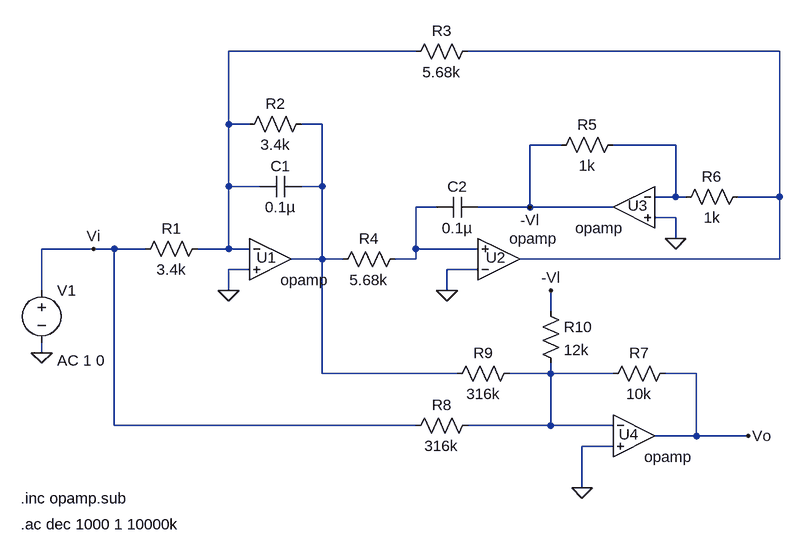
[diagram p0: schematic Circuito_8c.asc]
Circuito_8c.asc, the LTspice schematic file:
Version 4
SHEET 1 1172 680
WIRE 352 -176 64 -176
WIRE 912 -176 432 -176
WIRE 64 -64 64 -176
WIRE 96 -64 64 -64
WIRE 208 -64 176 -64
WIRE 576 -32 528 -32
WIRE 752 -32 656 -32
WIRE 64 32 64 -64
WIRE 112 32 64 32
WIRE 208 32 208 -64
WIRE 208 32 176 32
WIRE 752 48 752 -32
WIRE 752 48 720 48
WIRE 768 48 752 48
WIRE 912 48 912 -176
WIRE 912 48 848 48
WIRE 384 64 352 64
WIRE 528 64 528 -32
WIRE 528 64 448 64
WIRE 656 64 528 64
WIRE 752 80 720 80
WIRE 752 112 752 80
WIRE -144 128 -224 128
WIRE -112 128 -144 128
WIRE -64 128 -112 128
WIRE 64 128 64 32
WIRE 64 128 16 128
WIRE 96 128 64 128
WIRE 352 128 352 64
WIRE 448 128 352 128
WIRE 208 144 208 32
WIRE 208 144 160 144
WIRE 240 144 208 144
WIRE 352 144 352 128
WIRE 352 144 320 144
WIRE 912 144 912 48
WIRE 912 144 512 144
WIRE 96 160 64 160
WIRE 448 160 400 160
WIRE -224 192 -224 128
WIRE 64 192 64 160
WIRE 400 192 400 160
WIRE 560 224 560 192
WIRE -224 288 -224 272
WIRE 208 320 208 144
WIRE 416 320 208 320
WIRE 560 320 560 304
WIRE 560 320 496 320
WIRE 656 320 560 320
WIRE 784 320 736 320
WIRE -112 400 -112 128
WIRE 352 400 -112 400
WIRE 560 400 560 320
WIRE 560 400 432 400
WIRE 656 400 560 400
WIRE 784 416 784 320
WIRE 784 416 720 416
WIRE 864 416 784 416
WIRE 656 432 608 432
WIRE 608 496 608 432
FLAG 864 416 Vo
FLAG -144 128 Vi
FLAG 64 192 0
FLAG 400 192 0
FLAG 752 112 0
FLAG 608 496 0
FLAG -224 288 0
FLAG 528 64 -Vl
FLAG 560 192 -Vl
SYMBOL OpAmps\\opamp 128 80 R0
WINDOW 0 -21 61 Left 2
SYMATTR InstName U1
SYMBOL OpAmps\\opamp 480 208 M180
WINDOW 0 -20 67 Left 2
SYMATTR InstName U2
SYMBOL OpAmps\\opamp 688 0 M0
WINDOW 0 -21 61 Left 2
SYMATTR InstName U3
SYMBOL OpAmps\\opamp 688 352 R0
WINDOW 0 -23 62 Left 2
SYMATTR InstName U4
SYMBOL res 32 112 R90
WINDOW 0 0 56 VBottom 2
WINDOW 3 32 56 VTop 2
SYMATTR InstName R1
SYMATTR Value 3.4k
SYMBOL cap 176 16 R90
WINDOW 0 0 32 VBottom 2
WINDOW 3 32 32 VTop 2
SYMATTR InstName C1
SYMATTR Value 0.1µ
SYMBOL res 192 -80 R90
WINDOW 0 0 56 VBottom 2
WINDOW 3 32 56 VTop 2
SYMATTR InstName R2
SYMATTR Value 3.4k
SYMBOL res 448 -192 R90
WINDOW 0 0 56 VBottom 2
WINDOW 3 32 56 VTop 2
SYMATTR InstName R3
SYMATTR Value 5.68k
SYMBOL res 336 128 R90
WINDOW 0 0 56 VBottom 2
WINDOW 3 32 56 VTop 2
SYMATTR InstName R4
SYMATTR Value 5.68k
SYMBOL cap 448 48 R90
WINDOW 0 0 32 VBottom 2
WINDOW 3 32 32 VTop 2
SYMATTR InstName C2
SYMATTR Value 0.1µ
SYMBOL res 672 -48 R90
WINDOW 0 0 56 VBottom 2
WINDOW 3 32 56 VTop 2
SYMATTR InstName R5
SYMATTR Value 1k
SYMBOL res 864 32 R90
WINDOW 0 0 56 VBottom 2
WINDOW 3 32 56 VTop 2
SYMATTR InstName R6
SYMATTR Value 1k
SYMBOL res 752 304 R90
WINDOW 0 0 56 VBottom 2
WINDOW 3 32 56 VTop 2
SYMATTR InstName R7
SYMATTR Value 10k
SYMBOL res 448 384 R90
WINDOW 0 0 56 VBottom 2
WINDOW 3 32 56 VTop 2
SYMATTR InstName R8
SYMATTR Value 316k
SYMBOL res 512 304 R90
WINDOW 0 0 56 VBottom 2
WINDOW 3 32 56 VTop 2
SYMATTR InstName R9
SYMATTR Value 316k
SYMBOL voltage -224 176 R0
WINDOW 123 24 124 Left 2
WINDOW 39 0 0 Left 0
SYMATTR Value2 AC 1 0
SYMATTR InstName V1
SYMATTR Value ""
SYMBOL res 544 208 R0
SYMATTR InstName R10
SYMATTR Value 12k
TEXT -256 512 Left 2 !.inc opamp.sub
TEXT -256 552 Left 2 !.ac dec 1000 1 10000k

The netlist it stands for:
* Circuito_8c.asc
XU1 N001 0 N003 opamp Aol=100K GBW=10Meg  ; pins invin noninvin out
XU2 0 N005 N002 opamp Aol=100K GBW=10Meg  ; pins invin noninvin out
XU3 N004 0 -Vl opamp Aol=100K GBW=10Meg  ; pins invin noninvin out
XU4 N006 0 Vo opamp Aol=100K GBW=10Meg  ; pins invin noninvin out
R1 N001 Vi 3.4k
C1 N003 N001 0.1µ
R2 N003 N001 3.4k
R3 N002 N001 5.68k
R4 N005 N003 5.68k
C2 -Vl N005 0.1µ
R5 N004 -Vl 1k
R6 N002 N004 1k
R7 Vo N006 10k
R8 N006 Vi 316k
R9 N006 N003 316k
V1 Vi 0 AC 1 0
R10 -Vl N006 12k
.inc opamp.sub
.ac dec 1000 1 10000k
.backanno
.end